# Altium schematic sheet SH3 - CONNECTORS_2.SchDoc: Connectors 2
size B; CheckedBy: Lance Bantoto; DrawnBy: Kyle Hong; Engineer: Kyle Hong; Revision: 2; SheetNumber: 3; SheetTotal: 8
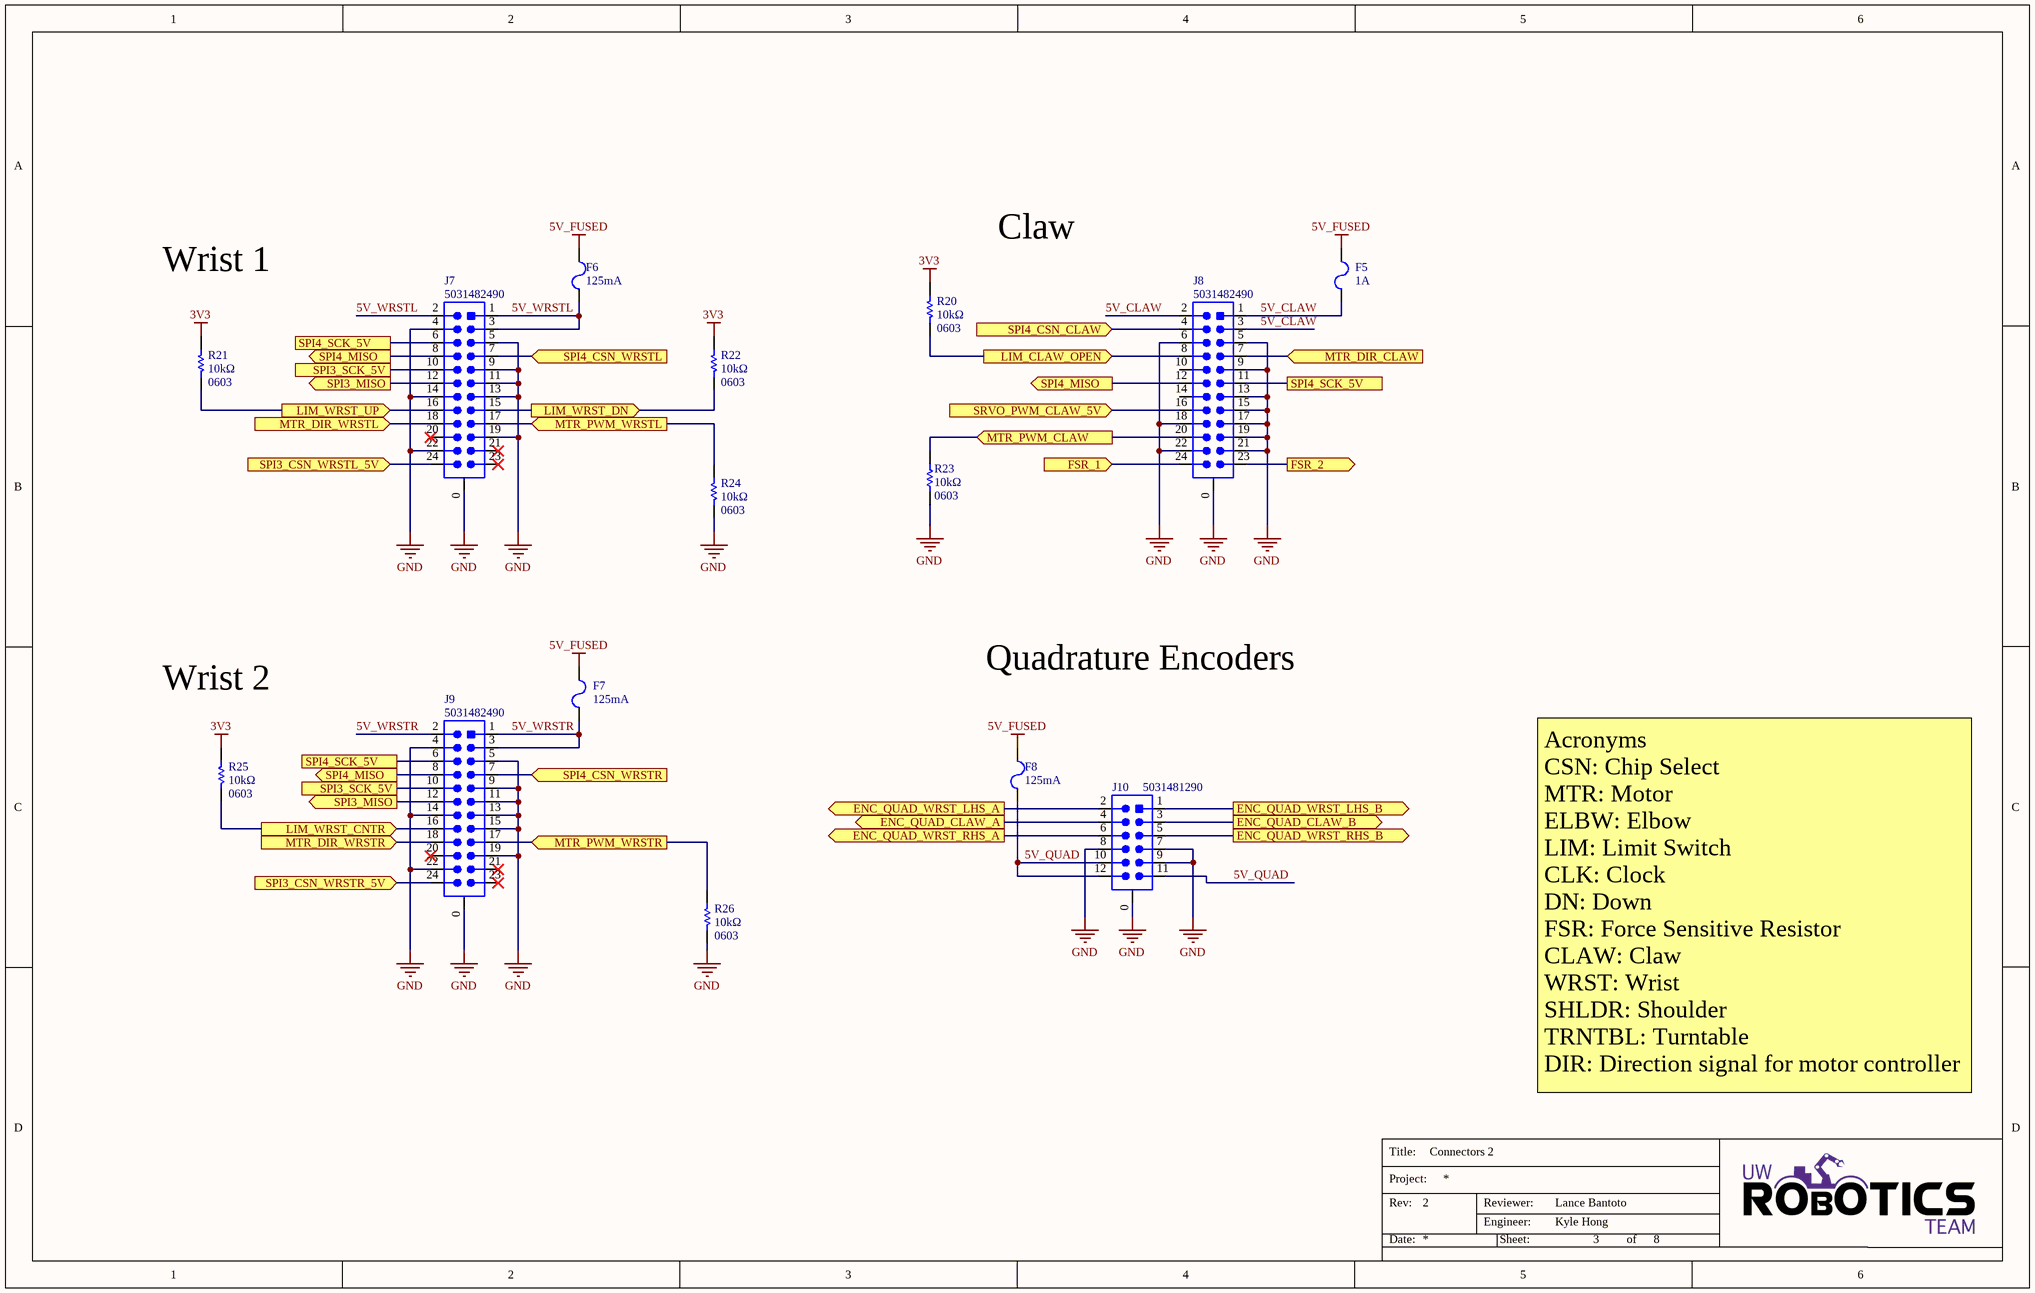
[diagram p0: SH3 - CONNECTORS_2.SchDoc]

## Parts
F5  Current Rating: 1A  [FUSE_1206]  (hidden comment: FUSE_1A_1206)
F6  Current Rating: 125mA  [FUSE_1206]  (hidden comment: FUSE_125mA_1206)
F7  Current Rating: 125mA  [FUSE_1206]  (hidden comment: FUSE_125mA_1206)
F8  Current Rating: 125mA  [FUSE_1206]  (hidden comment: FUSE_125mA_1206)
J7  Manufacturer Part Number 1: 5031482490  [MOLEX-5031482490]  (hidden comment: CON_12x2M_SM_RA)
J8  Manufacturer Part Number 1: 5031482490  [MOLEX-5031482490]  (hidden comment: CON_12x2M_SM_RA)
J9  Manufacturer Part Number 1: 5031482490  [MOLEX-5031482490]  (hidden comment: CON_12x2M_SM_RA)
J10  Manufacturer Part Number 1: 5031481290  [MOLEX-5031481290]  (hidden comment: CON_6x2M_SM_RA)
R20  value 10kΩ  Package/Footprint: 0603  [RESC0603]  (hidden comment: RES_10kΩ_0603_5%)
R21  value 10kΩ  Package/Footprint: 0603  [RESC0603]  (hidden comment: RES_10kΩ_0603_5%)
R22  value 10kΩ  Package/Footprint: 0603  [RESC0603]  (hidden comment: RES_10kΩ_0603_5%)
R23  value 10kΩ  Package/Footprint: 0603  [RESC0603]  (hidden comment: RES_10kΩ_0603_5%)
R24  value 10kΩ  Package/Footprint: 0603  [RESC0603]  (hidden comment: RES_10kΩ_0603_5%)
R25  value 10kΩ  Package/Footprint: 0603  [RESC0603]  (hidden comment: RES_10kΩ_0603_5%)
R26  value 10kΩ  Package/Footprint: 0603  [RESC0603]  (hidden comment: RES_10kΩ_0603_5%)

## Ports
ENC_QUAD_CLAW_A (out), ENC_QUAD_CLAW_B (out), ENC_QUAD_WRST_LHS_A (out), ENC_QUAD_WRST_LHS_B (out), ENC_QUAD_WRST_RHS_A (out), ENC_QUAD_WRST_RHS_B (out), FSR_1 (in), FSR_2 (out), LIM_CLAW_OPEN (out), LIM_WRST_CNTR (out), LIM_WRST_DN (out), LIM_WRST_UP (out), MTR_DIR_CLAW (in), MTR_DIR_WRSTL (in), MTR_DIR_WRSTR (in), MTR_PWM_CLAW (in), MTR_PWM_WRSTL (in), MTR_PWM_WRSTR (in), SPI3_CSN_WRSTL_5V (in), SPI3_CSN_WRSTR_5V (in), SPI3_MISO (out), SPI3_SCK_5V, SPI4_CSN_CLAW (in), SPI4_CSN_WRSTL (in), SPI4_CSN_WRSTR (in), SPI4_MISO (out), SPI4_SCK_5V, SRVO_PWM_CLAW_5V (in)

## Nets
3V3: R20.2 R21.2 R22.2 R25.2
5V_FUSED: F5.2 F6.2 F7.2 F8.2
GND: J7.0 J7.4 J7.5 J7.9 J7.11 J7.13 J7.14 J7.19 J7.22 J8.0 J8.5 J8.6 J8.9 J8.13 J8.15 J8.17 J8.18 J8.19 J8.21 J8.22 J9.0 J9.4 J9.5 J9.9 J9.11 J9.13 J9.14 J9.15 J9.19 J9.22 J10.0 J10.7 J10.8 J10.9 R23.1 R24.1 R26.1
5V_CLAW: F5.1 J8.1 J8.2 J8.3
5V_QUAD: F8.1 J10.10 J10.11 J10.12
5V_WRSTL: F6.1 J7.1 J7.2 J7.3
5V_WRSTR: F7.1 J9.1 J9.2 J9.3
ENC_QUAD_CLAW_A: J10.4 ; port ENC_QUAD_CLAW_A
ENC_QUAD_CLAW_B: J10.3 ; port ENC_QUAD_CLAW_B
ENC_QUAD_WRST_LHS_A: J10.2 ; port ENC_QUAD_WRST_LHS_A
ENC_QUAD_WRST_LHS_B: J10.1 ; port ENC_QUAD_WRST_LHS_B
ENC_QUAD_WRST_RHS_A: J10.6 ; port ENC_QUAD_WRST_RHS_A
ENC_QUAD_WRST_RHS_B: J10.5 ; port ENC_QUAD_WRST_RHS_B
FSR_1: J8.24 ; port FSR_1
FSR_2: J8.23 ; port FSR_2
LIM_CLAW_OPEN: J8.8 R20.1 ; port LIM_CLAW_OPEN
LIM_WRST_CNTR: J9.16 R25.1 ; port LIM_WRST_CNTR
LIM_WRST_DN: J7.15 R22.1 ; port LIM_WRST_DN
LIM_WRST_UP: J7.16 R21.1 ; port LIM_WRST_UP
MTR_DIR_CLAW: J8.7 ; port MTR_DIR_CLAW
MTR_DIR_WRSTL: J7.18 ; port MTR_DIR_WRSTL
MTR_DIR_WRSTR: J9.18 ; port MTR_DIR_WRSTR
MTR_PWM_CLAW: J8.20 R23.2 ; port MTR_PWM_CLAW
MTR_PWM_WRSTL: J7.17 R24.2 ; port MTR_PWM_WRSTL
MTR_PWM_WRSTR: J9.17 R26.2 ; port MTR_PWM_WRSTR
SPI3_CSN_WRSTL_5V: J7.24 ; port SPI3_CSN_WRSTL_5V
SPI3_CSN_WRSTR_5V: J9.24 ; port SPI3_CSN_WRSTR_5V
SPI3_MISO: J7.12 J9.12 ; port SPI3_MISO
SPI3_SCK_5V: J7.10 J9.10 ; port SPI3_SCK_5V
SPI4_CSN_CLAW: J8.4 ; port SPI4_CSN_CLAW
SPI4_CSN_WRSTL: J7.7 ; port SPI4_CSN_WRSTL
SPI4_CSN_WRSTR: J9.7 ; port SPI4_CSN_WRSTR
SPI4_MISO: J7.8 J8.12 J9.8 ; port SPI4_MISO
SPI4_SCK_5V: J7.6 J8.11 J9.6 ; port SPI4_SCK_5V
SRVO_PWM_CLAW_5V: J8.16 ; port SRVO_PWM_CLAW_5V

Not connected (* = marked no-connect by the designer): J7 20* 21* 23*; J8 10 14; J9 20* 21* 23*

## Notes on the sheet
- Wrist 1
- Claw
- Wrist 2
- Quadrature Encoders
- Acronyms
  CSN: Chip Select
  MTR: Motor
  ELBW: Elbow
  LIM: Limit Switch
  CLK: Clock
  DN: Down
  FSR: Force Sensitive Resistor
  CLAW: Claw
  WRST: Wrist
  SHLDR: Shoulder
  TRNTBL: Turntable
  DIR: Direction signal for motor controller
- Title:
- Project:
- Date:
- Rev:
- Reviewer:
- Engineer:
- Sheet:
- of

## Library data of the parts
F5 = FUSE_1A_1206: FUSE BOARD MOUNT 1A 125VAC 63VDC; Manufacturer 1: Bel Fuse Inc.; Manufacturer Part Number 1: C1Q 1; Package/Footprint: 1206; Supplier 1: Digi-Key; Supplier Part Number 1: 507-1077-1-ND; Mounting Type: SMD; LCSC Part #: *
F6-F8 = FUSE_125mA_1206: FUSE BOARD MNT 125MA 125VAC/VDC; Manufacturer 1: Littelfuse; Manufacturer Part Number 1: 0466.125NR; Voltage Rating (DC): 125V; Package/Footprint: 1206; Supplier 1: Digi-Key; Supplier Part Number 1: F1450CT-ND; Mounting Type: SMD
J7-J9 = CON_12x2M_SM_RA: CONN HEADER SMD RIGHT ANGLE 1.5MM PITCH; Manufacturer 1: Molex; Voltage Rating: 100V; Current Rating: 2A; Supplier 1: Digi-Key; Orientation: Right Angle; Pitch: 1.5mm; Supplier Part Number 1: WM20820CT-ND; Family: CLIK-Mate; Mounting Type: SMD; Package/Footprint: SMD
J10 = CON_6x2M_SM_RA: CONN HEADER SMD RIGHT ANGLE 1.5MM PITCH; Manufacturer 1: Molex; Voltage Rating: 100V; Current Rating: 1A; Supplier 1: Digi-Key; Orientation: Right Angle; Pitch: 1.5mm; Supplier Part Number 1: WM14476CT-ND; Mounting Type: SMD; Package/Footprint: SMD
R20-R26 = RES_10kΩ_0603_5%: RES 10K OHM 5% 1/10W 0603; Manufacturer 1: Yageo; Manufacturer Part Number 1: RC0603JR-0710KL; Supplier Part Number 1: 311-10KGRCT-ND; Supplier 1: Digi-Key; Mounting Type: SMD